# EAGLE board JugendLichtSteuerung (EAGLE 7.2.0), part 1 of 2
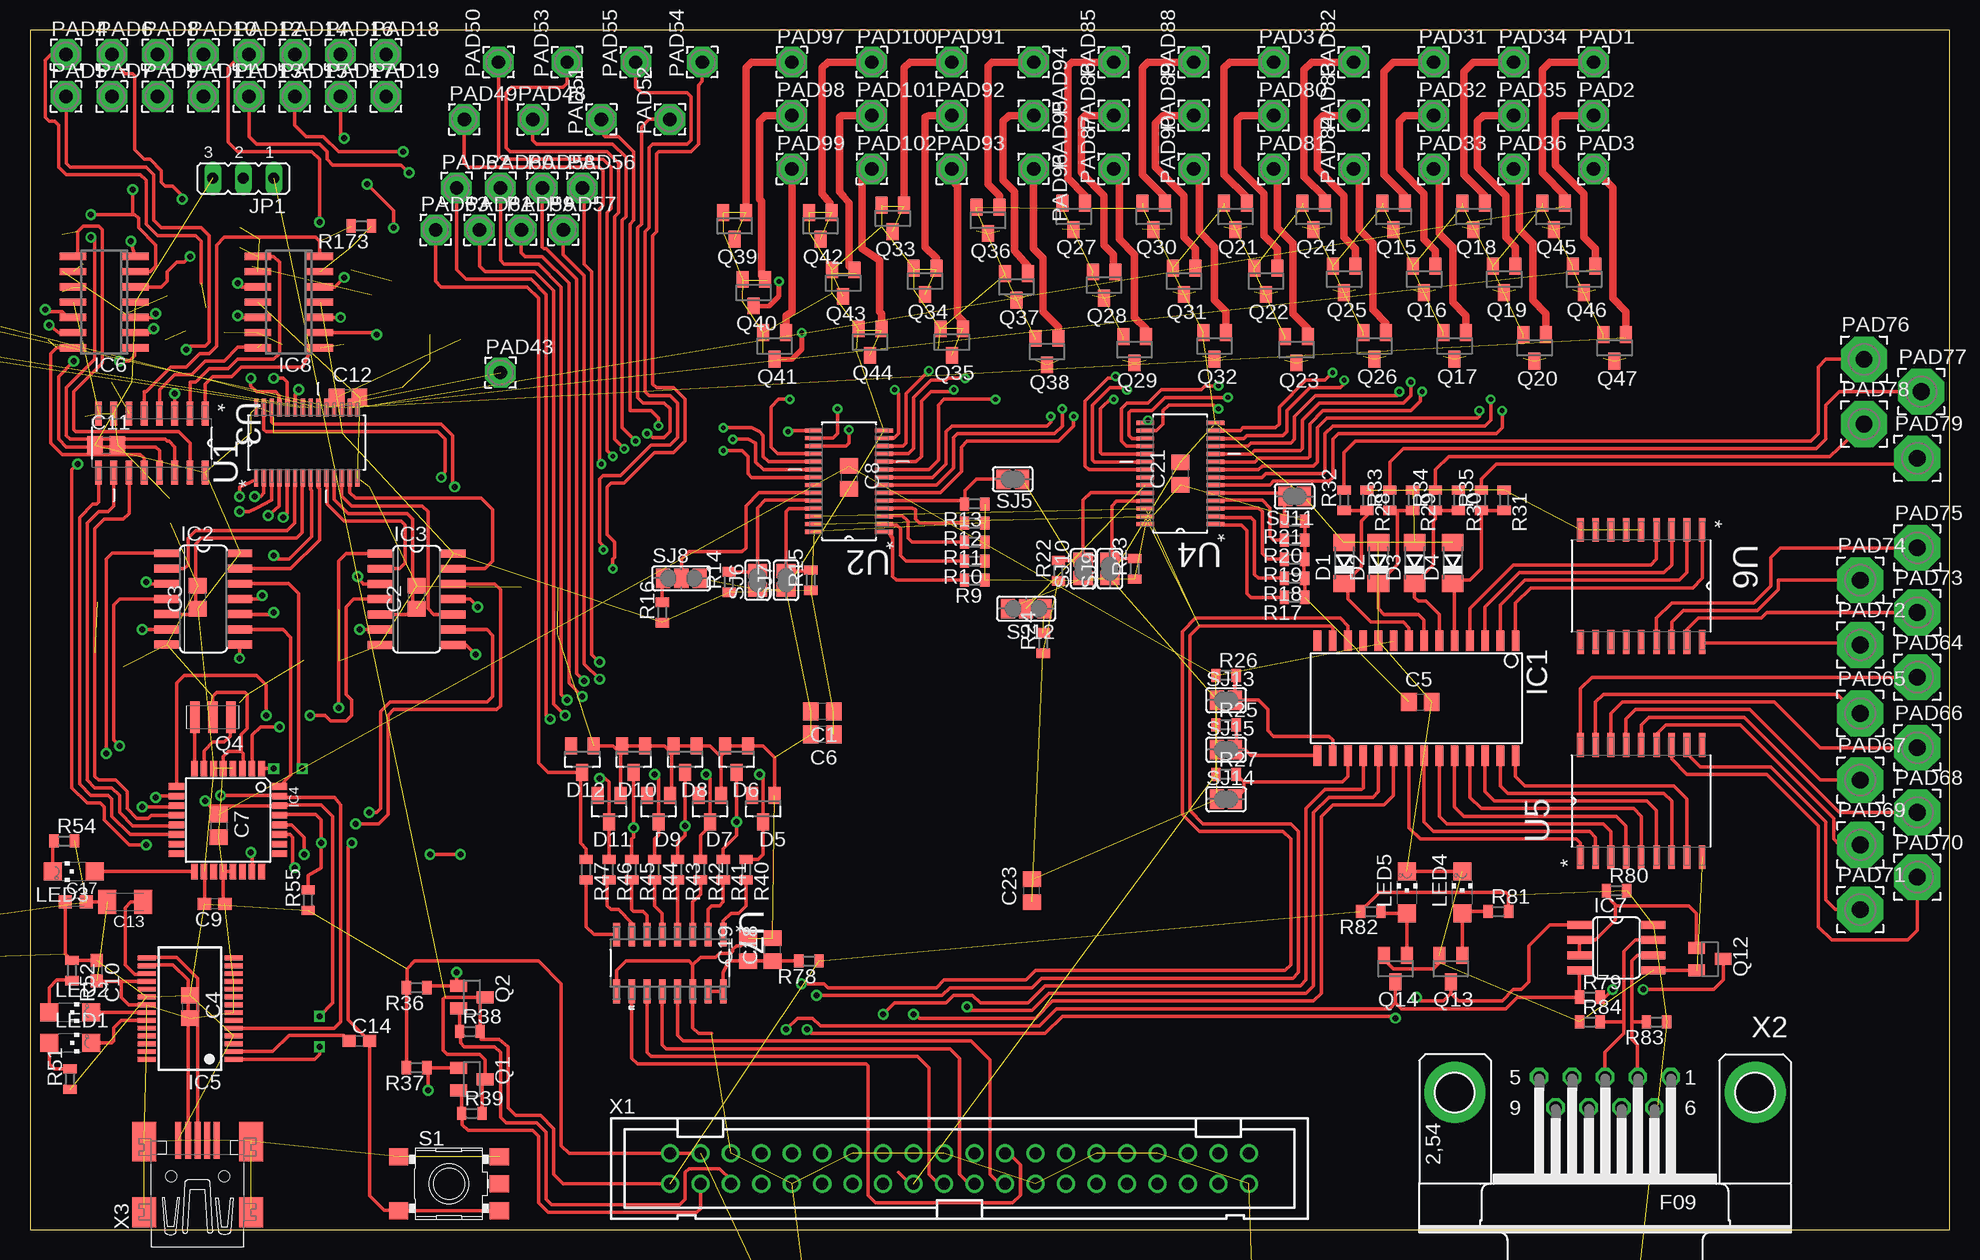
[diagram p5: board, top side]
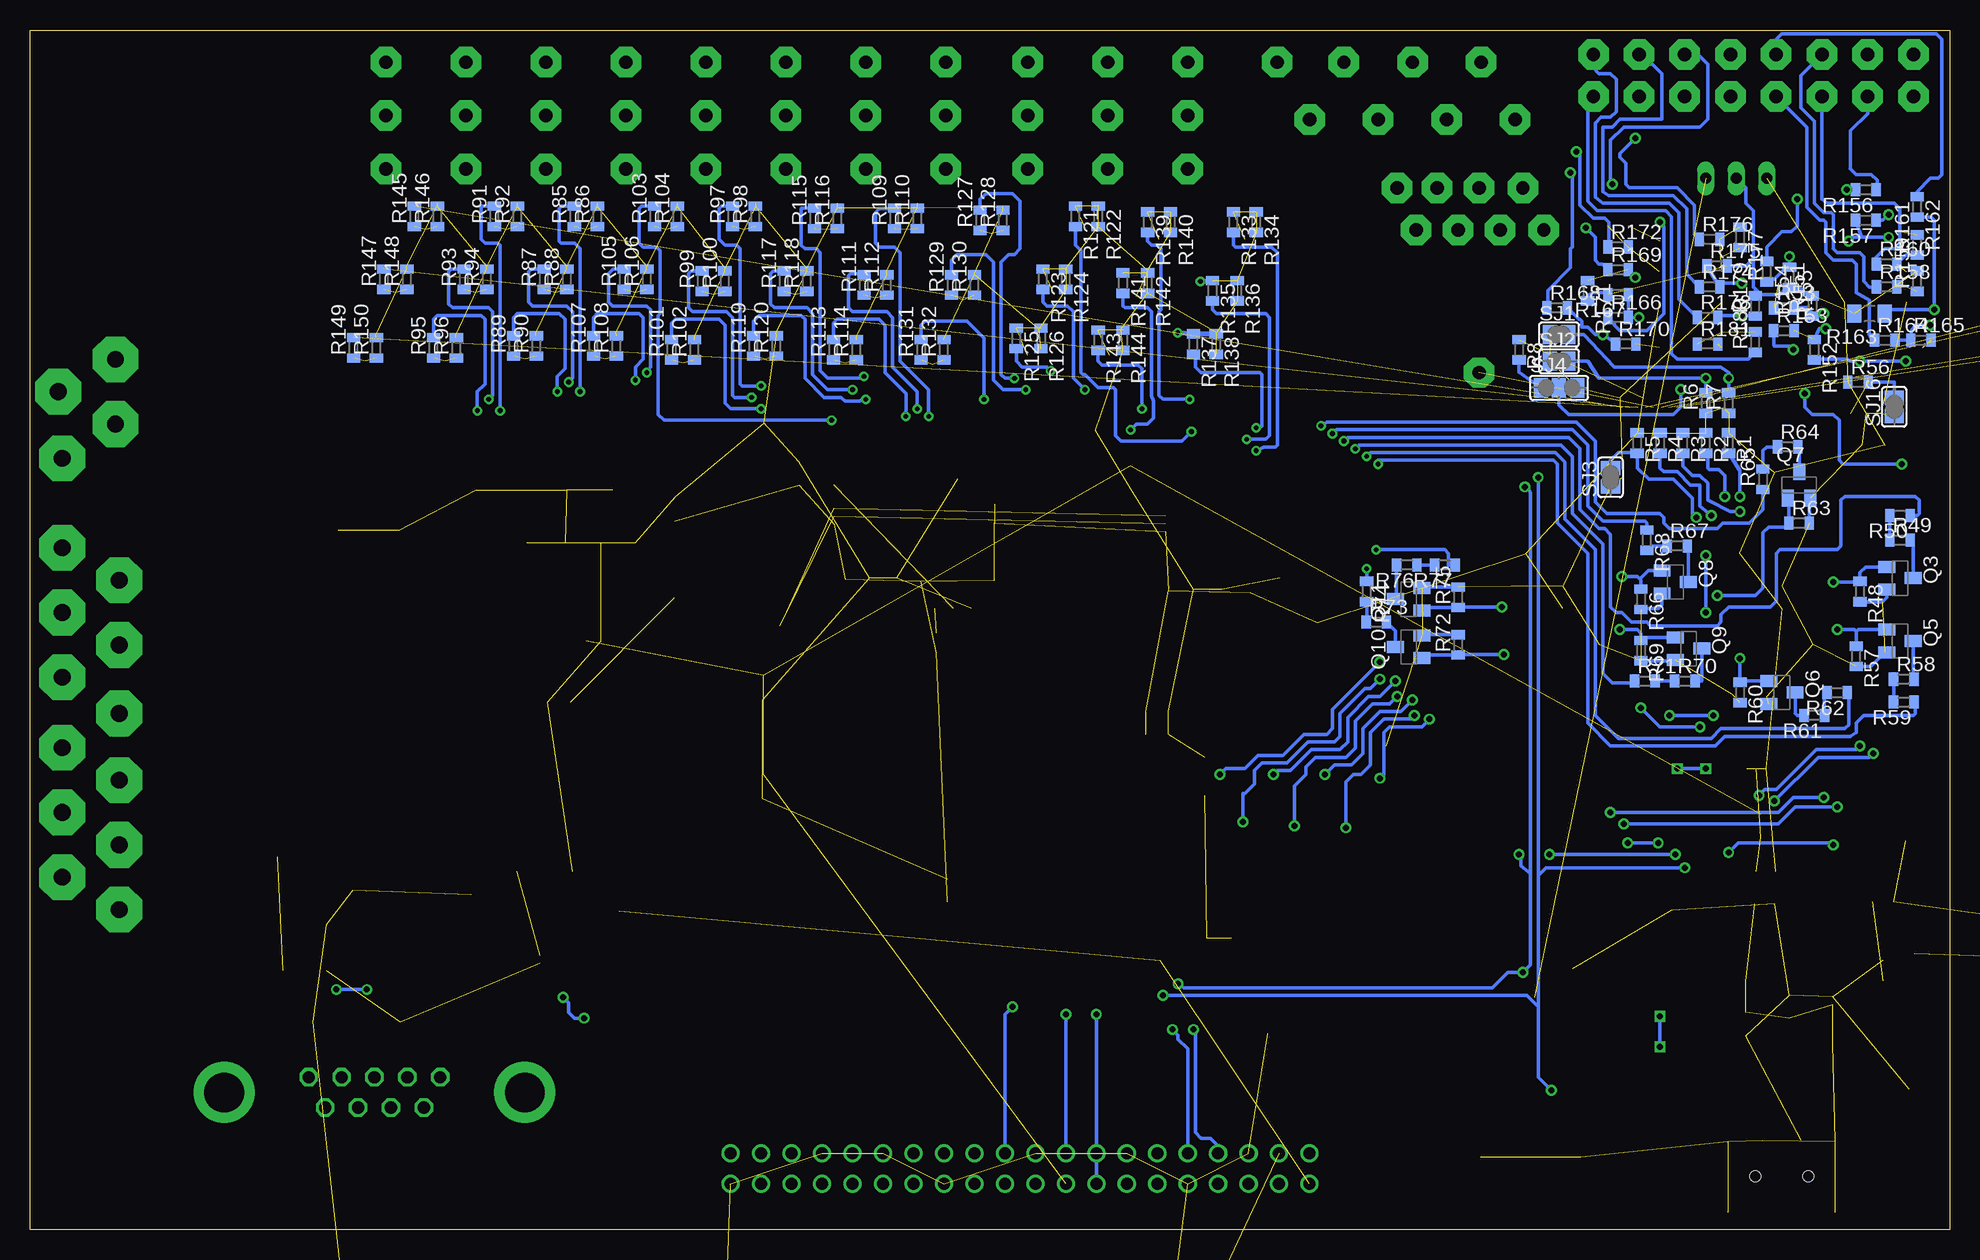
[diagram p6: board, bottom side, seen from below]

Size 160 x 100 mm. Coordinates in mm from the lower left corner, seen from the top.
Outline: 0,0 160,0 160,100 0,100 0,0
Copper layers (1*16): Top 0.035mm / dielectric 1.5mm / Bottom 0.035mm
Design rules "default": minimum track width 10mil, minimum drill 24mil, track to track 8mil, track to pad 8mil, pad to pad 8mil, via to via 8mil, smd to smd 8mil, copper to edge 40mil, drill to drill 8mil, minimum pad ring 10mil, minimum via ring 8mil, stop-mask expansion 4mil, vias tented up to drill 0mil, thermal gap 10mil

## Footprints (pad centres in the part's own frame; a part is rotated, then mirrored left to right if it is on the bottom)
C0805 = smd 1.3 x 1.5: 1 -0.95,0; 2 0.95,0
C0603 = smd 1.1 x 1: 1 -0.85,0; 2 0.85,0
C1206K = smd 1.5 x 2: 1 -1.5,0; 2 1.5,0
C0603K = smd 1.05 x 1.08: 1 -0.875,0; 2 0.875,0
SOD80C = smd 1.4 x 1.8: A 1.7,0; C -1.7,0
SOT23 = smd 1 x 1.4: 1 -0.95,-1.1; 2 0.95,-1.1; 3 0,1.1
SO28W = smd 0.65 x 1.7: 1 -7.62,-4.78; 2 -6.35,-4.78; 3 -5.08,-4.78; 4 -3.81,-4.78; 5 -2.54,-4.78; 6 -1.27,-4.78; 7 0,-4.78; 8 1.27,-4.78; 9 2.54,-4.78; 10 3.81,-4.78; 11 5.08,-4.78; 12 6.35,-4.78; 13 7.62,-4.78; 14 8.89,-4.78; 15 8.89,4.78; 16 7.62,4.78; 17 6.35,4.78; 18 5.08,4.78; 19 3.81,4.78; 20 2.54,4.78; 21 1.27,4.78; 22 0,4.78; 23 -1.27,4.78; 24 -2.54,4.78; 25 -3.81,4.78; 26 -5.08,4.78; 27 -6.35,4.78; 28 -7.62,4.78
SO14 = smd 0.66 x 2.032: 1 -3.81,-3.073; 2 -2.54,-3.073; 3 -1.27,-3.073; 4 0,-3.073; 5 1.27,-3.073; 6 2.54,-3.073; 7 3.81,-3.073; 8 3.81,3.073; 9 2.54,3.073; 10 1.27,3.073; 11 0,3.073; 12 -1.27,3.073; 13 -2.54,3.073; 14 -3.81,3.073
TQFP32-08 = smd 1.27 x 0.559: 1 -4.293,2.8; 2 -4.293,2; 3 -4.293,1.2; 4 -4.293,0.4; 5 -4.293,-0.4; 6 -4.293,-1.2; 7 -4.293,-2; 8 -4.293,-2.8; 17 4.293,-2.8; 18 4.293,-2; 19 4.293,-1.2; 20 4.293,-0.4; 21 4.293,0.4; 22 4.293,1.2; 23 4.293,2; 24 4.293,2.8 | smd 0.559 x 1.27: 9 -2.8,-4.293; 10 -2,-4.293; 11 -1.2,-4.293; 12 -0.4,-4.293; 13 0.4,-4.293; 14 1.2,-4.293; 15 2,-4.293; 16 2.8,-4.293; 25 2.8,4.293; 26 2,4.293; 27 1.2,4.293; 28 0.4,4.293; 29 -0.4,4.293; 30 -1.2,4.293; 31 -2,4.293; 32 -2.8,4.293
SSOP28 = smd 0.4 x 1.5: 1 -4.225,-3.625; 2 -3.575,-3.625; 3 -2.925,-3.625; 4 -2.275,-3.625; 5 -1.625,-3.625; 6 -0.975,-3.625; 7 -0.325,-3.625; 8 0.325,-3.625; 9 0.975,-3.625; 10 1.625,-3.625; 11 2.275,-3.625; 12 2.925,-3.625; 13 3.575,-3.625; 14 4.225,-3.625; 15 4.225,3.625; 16 3.575,3.625; 17 2.925,3.625; 18 2.275,3.625; 19 1.625,3.625; 20 0.975,3.625; 21 0.325,3.625; 22 -0.325,3.625; 23 -0.975,3.625; 24 -1.625,3.625; 25 -2.275,3.625; 26 -2.925,3.625; 27 -3.575,3.625; 28 -4.225,3.625
SO14' = smd 0.6 x 2.2: 1 -3.81,-2.6; 2 -2.54,-2.6; 3 -1.27,-2.6; 4 0,-2.6; 5 1.27,-2.6; 6 2.54,-2.6; 7 3.81,-2.6; 8 3.81,2.6; 9 2.54,2.6; 10 1.27,2.6; 11 0,2.6; 12 -1.27,2.6; 13 -2.54,2.6; 14 -3.81,2.6
SO08 = smd 0.66 x 2.032: 1 -1.905,-3.073; 2 -0.635,-3.073; 3 0.635,-3.073; 4 1.905,-3.073; 5 1.905,3.073; 6 0.635,3.073; 7 -0.635,3.073; 8 -1.905,3.073
JP2 = drill 0.914 long: 1 -2.54,0; 2 0,0; 3 2.54,0
CHIPLED_1206 = smd 1.5 x 1.5: A 0,-1.75; C 0,1.75
2,54/1,1 = drill 1.118 pad 2.54 octagon: 1 0,0
3,81/1,4 = drill 1.397 pad 3.81 octagon: 1 0,0
SOT23-BEC = smd 1 x 1.4: B -0.95,-1.1; C 0,1.1; E 0.95,-1.1
CSTCR6M = smd 0.8 x 2.6: 1 -1.5,0; 2 0,0; 3 1.5,0
R0603 = smd 0.771 x 1.1: 1 -0.85,0; 2 0.85,0
R0805 = smd 1.148 x 1.5: 1 -1.268,0; 2 1.268,0
SKHMPXE010 = smd 1.6 x 1.4: 1 -4.2,2.25; 2 4.2,2.25; 3 -4.2,-2.25; 4 4.2,-2.25; 5 4.2,0
SJ = smd 1.168 x 1.6: 1 -0.762,0; 2 0.762,0
SJ_2 = smd 1.168 x 1.6: 1 -1.524,0; 2 0,0; 3 1.524,0
SOP65P640X110-28N = smd 1.473 x 0.356: 1 -2.921,4.216; 2 -2.921,3.581; 3 -2.921,2.921; 4 -2.921,2.286; 5 -2.921,1.626; 6 -2.921,0.965; 7 -2.921,0.33; 8 -2.921,-0.33; 9 -2.921,-0.965; 10 -2.921,-1.626; 11 -2.921,-2.286; 12 -2.921,-2.921; 13 -2.921,-3.581; 14 -2.921,-4.216; 15 2.921,-4.216; 16 2.921,-3.581; 17 2.921,-2.921; 18 2.921,-2.286; 19 2.921,-1.626; 20 2.921,-0.965; 21 2.921,-0.33; 22 2.921,0.33; 23 2.921,0.965; 24 2.921,1.626; 25 2.921,2.286; 26 2.921,2.921; 27 2.921,3.581; 28 2.921,4.216
SOIC127P600X175-16N = smd 1.981 x 0.559: 1 -2.464,4.445; 2 -2.464,3.175; 3 -2.464,1.905; 4 -2.464,0.635; 5 -2.464,-0.635; 6 -2.464,-1.905; 7 -2.464,-3.175; 8 -2.464,-4.445; 9 2.464,-4.445; 10 2.464,-3.175; 11 2.464,-1.905; 12 2.464,-0.635; 13 2.464,0.635; 14 2.464,1.905; 15 2.464,3.175; 16 2.464,4.445
SOIC127P1030X265-18N = smd 1.981 x 0.559: 1 -4.674,5.08; 2 -4.674,3.81; 3 -4.674,2.54; 4 -4.674,1.27; 5 -4.674,0; 6 -4.674,-1.27; 7 -4.674,-2.54; 8 -4.674,-3.81; 9 -4.674,-5.08; 10 4.674,-5.08; 11 4.674,-3.81; 12 4.674,-2.54; 13 4.674,-1.27; 14 4.674,0; 15 4.674,1.27; 16 4.674,2.54; 17 4.674,3.81; 18 4.674,5.08
SOIC127P600X175-16N' = smd 1.981 x 0.559: 1 -2.362,4.445; 2 -2.362,3.175; 3 -2.362,1.905; 4 -2.362,0.635; 5 -2.362,-0.635; 6 -2.362,-1.905; 7 -2.362,-3.175; 8 -2.362,-4.445; 9 2.362,-4.445; 10 2.362,-3.175; 11 2.362,-1.905; 12 2.362,-0.635; 13 2.362,0.635; 14 2.362,1.905; 15 2.362,3.175; 16 2.362,4.445
PAK100/2500-40 = drill 1 pad 1.422: 1 -24.13,-1.27; 2 -24.13,1.27; 3 -21.59,-1.27; 4 -21.59,1.27; 5 -19.05,-1.27; 6 -19.05,1.27; 7 -16.51,-1.27; 8 -16.51,1.27; 9 -13.97,-1.27; 10 -13.97,1.27; 11 -11.43,-1.27; 12 -11.43,1.27; 13 -8.89,-1.27; 14 -8.89,1.27; 15 -6.35,-1.27; 16 -6.35,1.27; 17 -3.81,-1.27; 18 -3.81,1.27; 19 -1.27,-1.27; 20 -1.27,1.27; 21 1.27,-1.27; 22 1.27,1.27; 23 3.81,-1.27; 24 3.81,1.27; 25 6.35,-1.27; 26 6.35,1.27; 27 8.89,-1.27; 28 8.89,1.27; 29 11.43,-1.27; 30 11.43,1.27; 31 13.97,-1.27; 32 13.97,1.27; 33 16.51,-1.27; 34 16.51,1.27; 35 19.05,-1.27; 36 19.05,1.27; 37 21.59,-1.27; 38 21.59,1.27; 39 24.13,-1.27; 40 24.13,1.27
F09HP = drill 1.016 octagon: 1 -5.486,-1.27; 2 -2.743,-1.27; 3 0,-1.27; 4 2.743,-1.27; 5 5.486,-1.27; 6 -4.115,1.27; 7 -1.372,1.27; 8 1.372,1.27; 9 4.115,1.27 | drill 3.302 pad 5.08: G1 -12.522,0; G2 12.522,0
32005-301 = smd 3.1 x 0.5: 1 3,1.6; 2 3,0.8; 3 3,0; 4 3,-0.8; 5 3,-1.6 | smd 2.5 x 2: M1 -3,-4.45; M2 -3,4.45 | smd 3.3 x 2: M3 2.9,4.45; M4 2.9,-4.45 | hole 0.9: 0,2.2; 0,-2.2

## Placement (x,y rotation side)
C1  10µF  [C0805]  66.04,43.18 180 top
C2  100nF  [C0805]  32.23,52.7 90 top
C3  10µF  [C0805]  13.97,52.7 90 top
C4  100nF  [C0805]  13.34,18.57 270 top
C5  10µF  [C0805]  115.89,43.97 0 top
C6  100nF  [C0805]  66.04,41.27 180 top
C7  10µF  [C0805]  15.72,33.66 270 top
C8  100nF  [C0805]  68.26,62.71 270 top
C9  100n  [C0603]  15.4,27.15 180 top
C10  100n  [C0603]  5.56,21.59 270 top
C11  10µF  [C0805]  6.35,65.41 0 top
C12  10µF  [C0805]  26.51,69.37 0 top
C13  100n  [C1206K]  7.94,27.3 180 top
C14  100n  [C0603]  27.46,15.72 0 top
C15  100nF  [C0805]  -37.15,21.59 0 top  (outside the outline)
C16  100nF  [C0805]  -37.15,15.56 0 top  (outside the outline)
C17  100n  [C0603K]  3.81,27.3 0 top
C18  100nF  [C0805]  61.91,23.34 90 top
C19  10µF  [C0805]  59.85,23.34 90 top
C20  10µF  [C0805]  65.56,-13.34 90 top  (outside the outline)
C21  10µF  [C0805]  95.89,63.02 90 top
C22  100nF  [C0805]  102.08,-9.68 90 top  (outside the outline)
C23  100nF  [C0805]  83.5,28.26 90 top
C24  10µF  [C0805]  118.11,-7.62 90 top  (outside the outline)
C25  100nF  [C0805]  124.46,-7.62 90 top  (outside the outline)
C26  10µF  [C0805]  147.32,-7.62 90 top  (outside the outline)
C27  10µF  [C0805]  153.67,-7.62 90 top  (outside the outline)
C28  100nF  [C0805]  160.02,-7.62 90 top  (outside the outline)
C29  10µF  [C0805]  166.37,-7.62 90 top  (outside the outline)
C30  10µF  [C0805]  172.72,-7.62 90 top  (outside the outline)
C31  100nF  [C0805]  179.07,-7.62 90 top  (outside the outline)
D1  5V  [SOD80C]  109.54,55.56 90 top
D2  5V  [SOD80C]  112.39,55.56 90 top
D3  5V  [SOD80C]  115.41,55.56 90 top
D4  5V  [SOD80C]  118.59,55.56 90 top
D5  BAT54  [SOT23]  61.12,35.08 180 top
D6  BAT54  [SOT23]  58.9,39.21 180 top
D7  BAT54  [SOT23]  56.67,35.08 180 top
D8  BAT54  [SOT23]  54.61,39.21 180 top
D9  BAT54  [SOT23]  52.39,35.08 180 top
D10  BAT54  [SOT23]  50.32,39.21 180 top
D11  BAT54  [SOT23]  48.26,35.08 180 top
D12  BAT54  [SOT23]  46.04,39.21 180 top
D14  BAT54  [SOT23]  135.1,-4.76 90 top  (outside the outline)
D15  BAT54  [SOT23]  139.7,-8.89 90 top  (outside the outline)
D16  3.3V  [SOD80C]  184.31,-2.38 90 top  (outside the outline)
D17  5V  [SOD80C]  189.55,-4.76 90 top  (outside the outline)
IC1  MCP23017SO  [SO28W]  116.2,44.29 180 top
IC2  74LS08D  [SO14]  14.45,52.57 270 top
IC3  74LS08D  [SO14]  32.23,52.55 270 top
IC4  MEGA8-AI  [TQFP32-08]  16.51,34.13 270 top
IC5  FT232RL  [SSOP28]  13.34,18.41 90 top
IC6  LM324D  [SO14']  6.19,77.31 90 top
IC7  MAX481CSA  [SO08]  132.24,23.5 270 top
IC8  LM324D  [SO14']  21.59,77.31 90 top
JP1  [JP2]  17.78,87.63 180 top
LED1  orange  [CHIPLED_1206]  3.33,15.56 270 top
LED2  orange  [CHIPLED_1206]  3.33,18.1 270 top
LED3  GREEN  [CHIPLED_1206]  3.65,29.84 90 top
LED4  GREEN  [CHIPLED_1206]  119.38,28.1 0 top
LED5  GREEN  [CHIPLED_1206]  114.78,28.1 0 top
PAD1  WIREPAD2,54/1,1  [2,54/1,1]  130.33,97.31 0 top
PAD2  WIREPAD2,54/1,1  [2,54/1,1]  130.33,92.87 0 top
PAD3  WIREPAD2,54/1,1  [2,54/1,1]  130.33,88.42 0 top
PAD4  WIREPAD2,54/1,1  [2,54/1,1]  3.02,97.95 0 top
PAD5  WIREPAD2,54/1,1  [2,54/1,1]  3.02,94.46 0 top
PAD6  WIREPAD2,54/1,1  [2,54/1,1]  6.83,97.95 0 top
PAD7  WIREPAD2,54/1,1  [2,54/1,1]  6.83,94.46 0 top
PAD8  WIREPAD2,54/1,1  [2,54/1,1]  10.64,97.95 0 top
PAD9  WIREPAD2,54/1,1  [2,54/1,1]  10.64,94.46 0 top
PAD10  WIREPAD2,54/1,1  [2,54/1,1]  14.45,97.95 0 top
PAD11  WIREPAD2,54/1,1  [2,54/1,1]  14.45,94.46 0 top
PAD12  WIREPAD2,54/1,1  [2,54/1,1]  18.26,97.95 0 top
PAD13  WIREPAD2,54/1,1  [2,54/1,1]  18.26,94.46 0 top
PAD14  WIREPAD2,54/1,1  [2,54/1,1]  22.07,97.95 0 top
PAD15  WIREPAD2,54/1,1  [2,54/1,1]  22.07,94.46 0 top
PAD16  WIREPAD2,54/1,1  [2,54/1,1]  25.88,97.95 0 top
PAD17  WIREPAD2,54/1,1  [2,54/1,1]  25.88,94.46 0 top
PAD18  WIREPAD2,54/1,1  [2,54/1,1]  29.69,97.95 0 top
PAD19  WIREPAD2,54/1,1  [2,54/1,1]  29.69,94.46 0 top
PAD31  WIREPAD2,54/1,1  [2,54/1,1]  117,97.31 0 top
PAD32  WIREPAD2,54/1,1  [2,54/1,1]  117,92.87 0 top
PAD33  WIREPAD2,54/1,1  [2,54/1,1]  117,88.42 0 top
PAD34  WIREPAD2,54/1,1  [2,54/1,1]  123.67,97.31 0 top
PAD35  WIREPAD2,54/1,1  [2,54/1,1]  123.67,92.87 0 top
PAD36  WIREPAD2,54/1,1  [2,54/1,1]  123.67,88.42 0 top
PAD37  WIREPAD2,54/1,1  [2,54/1,1]  103.66,97.31 0 top
PAD42  WIREPAD2,54/1,1  [2,54/1,1]  -19.53,78.74 0 top  (outside the outline)
PAD43  WIREPAD2,54/1,1  [2,54/1,1]  39.21,71.44 0 top
PAD44  WIREPAD2,54/1,1  [2,54/1,1]  -15.88,78.74 0 top  (outside the outline)
PAD45  WIREPAD2,54/1,1  [2,54/1,1]  -17.78,75.25 0 top  (outside the outline)
PAD46  WIREPAD2,54/1,1  [2,54/1,1]  -21.43,75.25 0 top  (outside the outline)
PAD48  WIREPAD2,54/1,1  [2,54/1,1]  41.91,92.55 0 top
PAD49  WIREPAD2,54/1,1  [2,54/1,1]  36.2,92.55 0 top
PAD50  WIREPAD2,54/1,1  [2,54/1,1]  39.05,97.31 90 top
PAD51  WIREPAD2,54/1,1  [2,54/1,1]  47.62,92.55 90 top
PAD52  WIREPAD2,54/1,1  [2,54/1,1]  53.34,92.55 90 top
PAD53  WIREPAD2,54/1,1  [2,54/1,1]  44.77,97.31 90 top
PAD54  WIREPAD2,54/1,1  [2,54/1,1]  56.04,97.31 90 top
PAD55  WIREPAD2,54/1,1  [2,54/1,1]  50.48,97.31 90 top
PAD56  WIREPAD2,54/1,1  [2,54/1,1]  46.04,86.84 0 top
PAD57  WIREPAD2,54/1,1  [2,54/1,1]  44.45,83.34 0 top
PAD58  WIREPAD2,54/1,1  [2,54/1,1]  42.7,86.84 0 top
PAD59  WIREPAD2,54/1,1  [2,54/1,1]  40.96,83.34 0 top
PAD60  WIREPAD2,54/1,1  [2,54/1,1]  39.21,86.84 0 top
PAD61  WIREPAD2,54/1,1  [2,54/1,1]  37.47,83.34 0 top
PAD62  WIREPAD2,54/1,1  [2,54/1,1]  35.56,86.84 0 top
PAD63  WIREPAD2,54/1,1  [2,54/1,1]  33.81,83.34 0 top
PAD64  [3,81/1,4]  157.32,46.04 0 top
PAD65  [3,81/1,4]  152.56,43.02 0 top
PAD66  [3,81/1,4]  157.32,40.16 0 top
PAD67  [3,81/1,4]  152.56,37.47 0 top
PAD68  [3,81/1,4]  157.32,34.77 0 top
PAD69  [3,81/1,4]  152.56,32.07 0 top
PAD70  [3,81/1,4]  157.32,29.37 0 top
PAD71  [3,81/1,4]  152.56,26.67 0 top
PAD72  [3,81/1,4]  152.56,48.74 0 top
PAD73  [3,81/1,4]  157.32,51.44 0 top
PAD74  [3,81/1,4]  152.56,54.13 0 top
PAD75  [3,81/1,4]  157.32,56.83 0 top
PAD76  [3,81/1,4]  152.88,72.55 0 top
PAD77  [3,81/1,4]  157.64,69.85 0 top
PAD78  [3,81/1,4]  152.88,67.15 0 top
PAD79  [3,81/1,4]  157.32,64.29 0 top
PAD80  WIREPAD2,54/1,1  [2,54/1,1]  103.66,92.87 0 top
PAD81  WIREPAD2,54/1,1  [2,54/1,1]  103.66,88.42 0 top
PAD82  WIREPAD2,54/1,1  [2,54/1,1]  110.33,97.31 90 top
PAD83  WIREPAD2,54/1,1  [2,54/1,1]  110.33,92.87 90 top
PAD84  WIREPAD2,54/1,1  [2,54/1,1]  110.33,88.42 90 top
PAD85  WIREPAD2,54/1,1  [2,54/1,1]  90.33,97.31 90 top
PAD86  WIREPAD2,54/1,1  [2,54/1,1]  90.33,92.87 90 top
PAD87  WIREPAD2,54/1,1  [2,54/1,1]  90.33,88.42 90 top
PAD88  WIREPAD2,54/1,1  [2,54/1,1]  97,97.31 90 top
PAD89  WIREPAD2,54/1,1  [2,54/1,1]  97,92.87 90 top
PAD90  WIREPAD2,54/1,1  [2,54/1,1]  97,88.42 90 top
PAD91  WIREPAD2,54/1,1  [2,54/1,1]  76.83,97.31 0 top
PAD92  WIREPAD2,54/1,1  [2,54/1,1]  76.83,92.87 0 top
PAD93  WIREPAD2,54/1,1  [2,54/1,1]  76.83,88.42 0 top
PAD94  WIREPAD2,54/1,1  [2,54/1,1]  83.66,97.31 270 top
PAD95  WIREPAD2,54/1,1  [2,54/1,1]  83.66,92.87 270 top
PAD96  WIREPAD2,54/1,1  [2,54/1,1]  83.66,88.42 270 top
PAD97  WIREPAD2,54/1,1  [2,54/1,1]  63.5,97.31 0 top
PAD98  WIREPAD2,54/1,1  [2,54/1,1]  63.5,92.87 0 top
PAD99  WIREPAD2,54/1,1  [2,54/1,1]  63.5,88.42 0 top
PAD100  WIREPAD2,54/1,1  [2,54/1,1]  70.17,97.31 0 top
PAD101  WIREPAD2,54/1,1  [2,54/1,1]  70.17,92.87 0 top
PAD102  WIREPAD2,54/1,1  [2,54/1,1]  70.17,88.42 0 top
Q1  MMBFJ3  [SOT23]  36.83,12.54 270 top
Q2  MMBFJ3  [SOT23]  36.83,19.37 270 top
Q3  BC817-16LT1SMD  [SOT23-BEC]  4.13,54.29 270 bottom
Q4  CSTCR6M00G53Z  [CSTCR6M]  15.24,42.7 180 top
Q5  BC817-16LT1SMD  [SOT23-BEC]  4.13,49.05 270 bottom
Q6  BC817-16LT1SMD  [SOT23-BEC]  13.97,44.77 270 bottom
Q7  BC817-16LT1SMD  [SOT23-BEC]  12.54,62.07 0 bottom
Q8  BC817-16LT1SMD  [SOT23-BEC]  22.86,53.98 270 bottom
Q9  BC817-16LT1SMD  [SOT23-BEC]  21.75,48.42 270 bottom
Q10  BC817-16LT1SMD  [SOT23-BEC]  45.09,48.58 90 bottom
Q11  BC817-16LT1SMD  [SOT23-BEC]  45.09,52.55 90 bottom
Q12  MMBFJ3  [SOT23]  140.02,22.54 270 top
Q13  MMBFJ3  [SOT23]  118.43,21.75 180 top
Q14  MMBFJ3  [SOT23]  113.82,21.75 180 top
Q15  MMBFJ3  [SOT23]  113.67,84.45 180 top
Q16  MMBFJ3  [SOT23]  116.2,79.22 180 top
Q17  MMBFJ3  [SOT23]  118.75,73.66 180 top
Q18  MMBFJ3  [SOT23]  120.33,84.45 180 top
Q19  MMBFJ3  [SOT23]  122.87,79.22 180 top
Q20  MMBFJ3  [SOT23]  125.41,73.5 180 top
Q21  MMBFJ3  [SOT23]  100.49,84.45 180 top
Q22  MMBFJ3  [SOT23]  103.03,79.06 180 top
Q23  MMBFJ3  [SOT23]  105.57,73.34 180 top
Q24  MMBFJ3  [SOT23]  107,84.45 180 top
Q25  MMBFJ3  [SOT23]  109.54,79.22 180 top
Q26  MMBFJ3  [SOT23]  112.08,73.66 180 top
Q27  MMBFJ3  [SOT23]  87,84.45 180 top
Q28  MMBFJ3  [SOT23]  89.53,78.74 180 top
Q29  MMBFJ3  [SOT23]  92.08,73.34 180 top
Q30  MMBFJ3  [SOT23]  93.66,84.45 180 top
Q31  MMBFJ3  [SOT23]  96.2,79.06 180 top
Q32  MMBFJ3  [SOT23]  98.74,73.66 180 top
Q33  MMBFJ3  [SOT23]  71.91,84.3 180 top
Q34  MMBFJ3  [SOT23]  74.61,79.06 180 top
Q35  MMBFJ3  [SOT23]  76.83,73.98 180 top
Q36  MMBFJ3  [SOT23]  79.85,84.14 180 top
Q37  MMBFJ3  [SOT23]  82.23,78.58 180 top
Q38  MMBFJ3  [SOT23]  84.77,73.18 180 top
Q39  MMBFJ3  [SOT23]  58.74,83.66 180 top
Q40  MMBFJ3  [SOT23]  60.33,78.11 180 top
Q41  MMBFJ3  [SOT23]  62.07,73.66 180 top
Q42  MMBFJ3  [SOT23]  65.88,83.66 180 top
Q43  MMBFJ3  [SOT23]  67.79,78.9 180 top
Q44  MMBFJ3  [SOT23]  70.01,73.98 180 top
Q45  MMBFJ3  [SOT23]  127,84.45 180 top
Q46  MMBFJ3  [SOT23]  129.54,79.22 180 top
Q47  MMBFJ3  [SOT23]  132.08,73.5 180 top
R1  [R0603]  18.41,65.56 270 bottom
R2  [R0603]  20.32,65.56 270 bottom
R3  [R0603]  22.23,65.56 270 bottom
R4  [R0603]  24.13,65.56 270 bottom
R5  [R0603]  26.04,65.56 270 bottom
R6  [R0603]  20.32,68.9 90 bottom
R7  [R0603]  18.41,68.9 90 bottom
R8  [R0603]  35.88,73.34 270 bottom
R9  [R0603]  78.74,54.13 180 top
R10  [R0603]  78.74,55.72 180 top
R11  [R0603]  78.74,57.31 180 top
R12  [R0603]  78.74,58.9 180 top
R13  [R0603]  78.74,60.48 180 top
R14  [R0603]  58.26,53.98 90 top
R15  [R0603]  65.09,54.13 90 top
R16  [R0603]  52.7,51.44 90 top
R17  [R0603]  105.41,52.7 180 top
R18  [R0603]  105.41,54.29 180 top
R19  [R0603]  105.41,55.88 180 top
R20  [R0603]  105.41,57.47 180 top
R21  [R0603]  105.41,59.05 180 top
R22  [R0603]  85.72,54.93 90 top
R23  [R0603]  92.08,55.09 90 top
R24  [R0603]  84.45,48.9 90 top
R25  [R0603]  99.69,42.07 0 top
R26  [R0603]  99.69,46.2 0 top
R27  [R0603]  99.69,37.94 0 top
R28  [R0603]  111.44,60.8 270 top
R29  [R0603]  115.25,60.8 270 top
R30  [R0603]  119.06,60.8 270 top
R31  [R0603]  122.87,60.8 270 top
R32  [R0603]  109.54,60.8 90 top
R33  [R0603]  113.35,60.8 90 top
R34  [R0603]  117.16,60.8 90 top
R35  [R0603]  120.97,60.8 90 top
R36  4k7  [R0603]  32.23,20.16 180 top
R37  4k7  [R0603]  32.23,13.49 180 top
R38  4k7  [R0603]  36.67,16.51 0 top
R39  4k7  [R0603]  36.83,9.68 0 top
R40  330R  [R0603]  59.69,30 270 top
R41  330R  [R0603]  57.78,30 270 top
R42  330R  [R0603]  55.88,30 270 top
R43  330R  [R0603]  53.98,30 270 top
R44  330R  [R0603]  52.07,30 270 top
R45  330R  [R0603]  50.16,30 270 top
R46  330R  [R0603]  48.26,30 270 top
R47  330R  [R0603]  46.35,30 270 top
R48  4k7  [R0603]  7.46,53.18 270 bottom
R49  330R  [R0603]  4.13,57.47 0 bottom
R50  330R  [R0603]  4.13,59.53 180 bottom
R51  680  [R0603]  3.33,12.54 90 top
R52  680  [R0603]  3.49,21.59 270 top
R53  4k7  [R0603]  13.81,76.83 0 bottom
R54  680  [R0603]  2.86,32.38 0 top
R55  10k  [R0603]  23.18,27.46 90 top
R56  4k7  [R0603]  7.62,70.64 0 bottom
R57  4k7  [R0603]  7.78,47.78 270 bottom
R58  330R  [R0603]  3.81,45.88 0 bottom
R59  330R  [R0603]  3.81,43.97 180 bottom
R60  4k7  [R0603]  17.46,44.77 270 bottom
R61  330R  [R0603]  11.27,42.86 180 bottom
R62  330R  [R0603]  9.37,44.77 180 bottom
R63  4k7  [R0603]  12.54,58.9 0 bottom
R64  330R  [R0603]  13.49,65.25 0 bottom
R65  330R  [R0603]  15.56,62.55 90 bottom
R66  4k7  [R0603]  25.72,52.55 270 bottom
R67  330R  [R0603]  22.7,56.99 0 bottom
R68  330R  [R0603]  25.24,57.47 270 bottom
R69  4k7  [R0603]  25.72,48.26 270 bottom
R70  330R  [R0603]  22.07,45.72 0 bottom
R71  330R  [R0603]  25.4,45.72 0 bottom
R72  4k7  [R0603]  40.96,48.74 90 bottom
R73  330R  [R0603]  47.78,50.64 0 bottom
R74  330R  [R0603]  48.58,53.18 270 bottom
R75  4k7  [R0603]  40.96,52.7 90 bottom
R76  330R  [R0603]  45.24,55.4 180 bottom
R77  330R  [R0603]  42.07,55.4 180 bottom
R78  10R  [R0603]  64.93,22.38 180 top
R79  [R0603]  130.02,19.37 0 top
R80  [R0603]  132.24,28.26 0 top
R81  510R  [R0603]  122.4,26.51 0 top
R82  510R  [R0603]  111.76,26.51 180 top
R83  10K  [R0603]  135.57,17.3 180 top
R84  10K  [R0603]  130.02,17.3 0 top
R85  100R  [R0603]  114.62,84.45 90 bottom
R86  4k7  [R0603]  112.71,84.45 90 bottom
R87  100R  [R0603]  117.16,79.22 90 bottom
R88  4k7  [R0603]  115.25,79.22 90 bottom
R89  100R  [R0603]  119.7,73.66 90 bottom
R90  4k7  [R0603]  117.79,73.66 90 bottom
R91  100R  [R0603]  121.28,84.45 90 bottom
R92  4k7  [R0603]  119.38,84.45 90 bottom
R93  100R  [R0603]  123.83,79.22 90 bottom
R94  4k7  [R0603]  121.92,79.22 90 bottom
R95  100R  [R0603]  126.36,73.5 90 bottom
R96  4k7  [R0603]  124.46,73.5 90 bottom
R97  100R  [R0603]  101.44,84.45 90 bottom
R98  4k7  [R0603]  99.54,84.45 90 bottom
R99  100R  [R0603]  103.98,79.06 90 bottom
R100  4k7  [R0603]  102.08,79.06 90 bottom
R101  100R  [R0603]  106.52,73.34 90 bottom
R102  4k7  [R0603]  104.62,73.34 90 bottom
R103  100R  [R0603]  107.95,84.45 90 bottom
R104  4k7  [R0603]  106.05,84.45 90 bottom
R105  100R  [R0603]  110.49,79.22 90 bottom
R106  4k7  [R0603]  108.58,79.22 90 bottom
R107  100R  [R0603]  113.03,73.66 90 bottom
R108  4k7  [R0603]  111.12,73.66 90 bottom
R109  100R  [R0603]  87.95,84.3 90 bottom
R110  4k7  [R0603]  86.04,84.3 90 bottom
R111  100R  [R0603]  90.49,78.74 90 bottom
R112  4k7  [R0603]  88.58,78.74 90 bottom
R113  100R  [R0603]  93.03,73.34 90 bottom
R114  4k7  [R0603]  91.12,73.34 90 bottom
R115  100R  [R0603]  94.61,84.3 90 bottom
R116  4k7  [R0603]  92.71,84.3 90 bottom
R117  100R  [R0603]  97.16,79.06 90 bottom
R118  4k7  [R0603]  95.25,79.06 90 bottom
R119  100R  [R0603]  99.69,73.66 90 bottom
R120  4k7  [R0603]  97.79,73.66 90 bottom
R121  100R  [R0603]  72.87,84.45 270 bottom
R122  4k7  [R0603]  70.96,84.45 270 bottom
R123  100R  [R0603]  75.56,79.22 270 bottom
R124  4k7  [R0603]  73.66,79.22 270 bottom
R125  100R  [R0603]  77.79,74.3 270 bottom
R126  4k7  [R0603]  75.72,74.3 270 bottom
R127  100R  [R0603]  80.8,84.14 90 bottom
R128  4k7  [R0603]  78.9,84.14 90 bottom
R129  100R  [R0603]  83.19,78.74 90 bottom
R130  4k7  [R0603]  81.28,78.74 90 bottom
R131  100R  [R0603]  85.72,73.34 90 bottom
R132  4k7  [R0603]  83.82,73.34 90 bottom
R133  100R  [R0603]  59.69,83.98 270 bottom
R134  4k7  [R0603]  57.78,83.98 270 bottom
R135  100R  [R0603]  61.44,78.26 270 bottom
R136  4k7  [R0603]  59.37,78.26 270 bottom
R137  100R  [R0603]  63.02,73.82 270 bottom
R138  4k7  [R0603]  61.12,73.82 270 bottom
R139  100R  [R0603]  66.83,83.98 270 bottom
R140  4k7  [R0603]  64.93,83.98 270 bottom
R141  100R  [R0603]  68.9,78.9 270 bottom
R142  4k7  [R0603]  66.83,78.9 270 bottom
R143  100R  [R0603]  70.96,74.14 270 bottom
R144  4k7  [R0603]  68.9,74.14 270 bottom
R145  100R  [R0603]  127.95,84.45 90 bottom
R146  4k7  [R0603]  126.05,84.45 90 bottom
R147  100R  [R0603]  130.49,79.22 90 bottom
R148  4k7  [R0603]  128.59,79.22 90 bottom
R149  100R  [R0603]  133.03,73.5 90 bottom
R150  4k7  [R0603]  131.13,73.5 90 bottom
R151  4k7  [R0603]  11.43,76.99 90 bottom
R152  4k7  [R0603]  11.27,73.34 270 bottom
R153  4k7  [R0603]  13.81,74.93 0 bottom
R154  4k7  [R0603]  15.24,79.85 270 bottom
R155  4k7  [R0603]  13.34,79.38 270 bottom
R156  4k7  [R0603]  6.99,86.68 180 bottom
R157  4k7  [R0603]  6.99,84.14 180 bottom
R158  4k7  [R0603]  5.24,78.58 0 bottom
R159  4k7  [R0603]  2.7,79.06 90 bottom
R160  4k7  [R0603]  5.24,80.49 0 bottom
R161  4k7  [R0603]  2.7,82.07 90 bottom
R162  4k7  [R0603]  2.7,85.25 270 bottom
R163  4k7  [R0805]  6.67,76.36 180 bottom
R164  4k7  [R0603]  5.4,74.14 0 bottom
R165  4k7  [R0603]  2.38,74.14 0 bottom
R166  4k7  [R0603]  27.62,76.04 0 bottom
R167  4k7  [R0603]  27.62,77.95 180 bottom
R168  4k7  [R0603]  32.7,76.83 0 bottom
R169  4k7  [R0603]  27.62,80.01 0 bottom
R170  4k7  [R0603]  26.99,73.82 0 bottom
R171  4k7  [R0603]  30.16,78.26 270 bottom
R172  4k7  [R0603]  27.62,81.92 0 bottom
R173  4k7  [R0603]  27.62,83.66 180 top
R174  4k7  [R0603]  20,78.58 0 bottom
R175  4k7  [R0603]  19.37,80.33 0 bottom
R176  4k7  [R0603]  20,82.55 0 bottom
R177  4k7  [R0603]  17.46,82.71 270 bottom
R178  4k7  [R0603]  20.16,76.04 0 bottom
R179  4k7  [R0603]  16.19,76.99 90 bottom
R180  4k7  [R0603]  16.19,73.98 90 bottom
R181  4k7  [R0603]  20.16,73.82 0 bottom
S1  SKHMPSE010  [SKHMPXE010]  34.92,3.81 0 top
SJ1  [SJ]  32.54,74.61 0 bottom
SJ2  [SJ]  32.54,72.39 0 bottom
SJ3  [SJ]  28.26,62.71 90 bottom
SJ4  [SJ_2]  32.54,70.17 0 bottom
SJ5  [SJ]  81.92,62.55 180 top
SJ6  [SJ]  60.64,54.13 90 top
SJ7  [SJ]  63.02,54.13 90 top
SJ8  [SJ_2]  54.29,54.29 0 top
SJ9  [SJ]  90.01,55.09 90 top
SJ10  [SJ]  87.79,55.09 90 top
SJ11  [SJ]  105.41,61.12 180 top
SJ12  [SJ_2]  83.03,51.75 180 top
SJ13  [SJ]  99.69,44.13 0 top
SJ14  [SJ]  99.69,35.88 0 top
SJ15  [SJ]  99.69,40.01 0 top
SJ16  [SJ]  4.6,68.58 90 bottom
U1  PCA9635PW  [SOP65P640X110-28N]  23.07,65.6 90 top
U2  PCA9635PW  [SOP65P640X110-28N]  68.26,62.39 180 top
U3  CD4051BM  [SOIC127P600X175-16N]  10.16,65.56 270 top
U4  PCA9635PW  [SOP65P640X110-28N]  95.89,63.02 180 top
U5  ULN2803ADWR  [SOIC127P1030X265-18N]  134.3,35.72 90 top
U6  ULN2803ADWR  [SOIC127P1030X265-18N]  134.3,53.66 270 top
U7  MCP3008-I/SL  [SOIC127P600X175-16N']  53.34,22.23 270 top
X1  2540-  [PAK100/2500-40]  77.47,5.08 0 top
X2  [F09HP]  131.29,11.43 180 top
X3  MINI-USB-SCHIELD-32005-301  [32005-301]  13.97,4.45 90 top